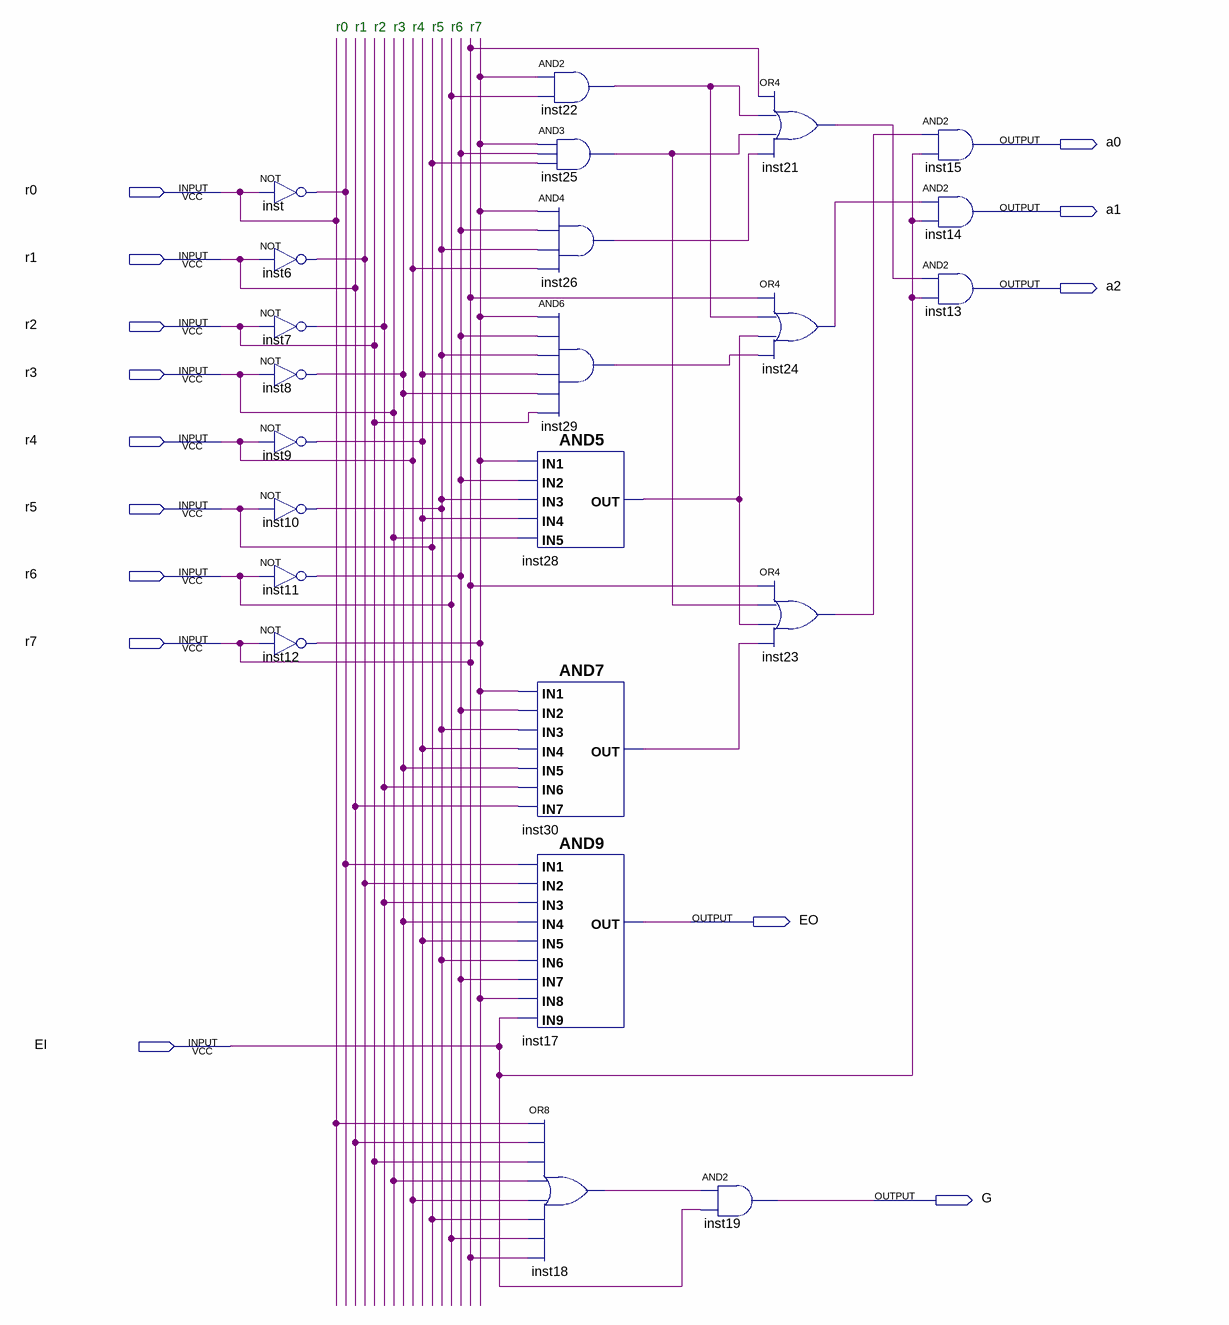
[diagram p0: schematic sheet]
// Quartus schematic hpri.bdf as structural Verilog: 23 symbols, 14 pins
module hpri (
  input  r0,
  input  r1,
  input  r2,
  input  r3,
  input  r4,
  input  r5,
  input  r6,
  input  r7,
  input  EI,
  output a0,
  output a1,
  output a2,
  output EO,
  output G
);

  wire inst6_out, inst7_out, inst8_out, inst9_out, inst10_out, inst11_out, inst12_out, inst18_out,
       inst21_out, inst22_out, inst23_out, inst24_out, inst25_out, inst26_out, inst28_out, inst29_out,
       inst30_out, inst_out;

  not inst (inst_out, r0);
  not inst6 (inst6_out, r1);
  not inst7 (inst7_out, r2);
  not inst8 (inst8_out, r3);
  not inst9 (inst9_out, r4);
  not inst10 (inst10_out, r5);
  not inst11 (inst11_out, r6);
  not inst12 (inst12_out, r7);
  and inst22 (inst22_out, inst12_out, r6);
  and inst25 (inst25_out, inst12_out, inst11_out, r5);
  and inst26 (inst26_out, inst12_out, inst11_out, inst10_out, r4);
  and inst29 (inst29_out, inst12_out, inst11_out, inst10_out, inst9_out, inst8_out, r2);
  and inst28 (inst28_out, inst12_out, inst11_out, inst10_out, inst9_out, r3);
  and inst30 (inst30_out, inst12_out, inst11_out, inst10_out, inst9_out, inst8_out, inst7_out, r1);
  and inst17 (EO, inst_out, inst6_out, inst7_out, inst8_out, inst9_out, inst10_out, inst11_out, inst12_out, EI);
  or inst18 (inst18_out, r0, r1, r2, r3, r4, r5, r6, r7);
  and inst19 (G, inst18_out, EI);
  or inst21 (inst21_out, r7, inst22_out, inst25_out, inst26_out);
  or inst24 (inst24_out, r7, inst22_out, inst28_out, inst29_out);
  or inst23 (inst23_out, r7, inst25_out, inst28_out, inst30_out);
  and inst15 (a0, inst23_out, EI);
  and inst14 (a1, inst24_out, EI);
  and inst13 (a2, inst21_out, EI);

  // Notes on the sheet:
  //   r0
  //   r1
  //   r2
  //   r3
  //   r4
  //   r5
  //   r6
  //   r7
endmodule
